# Altium project UCLA-DRS4-2.1.PrjPCB (part 5 of 7)

## Sheet 4V_DIST.SchDoc: My title
size A3; Organization: University of California; Address1: 475 Portola Plaza; Address2: Los Angeles, CA 90095; Revision: R01; SheetNumber: 1; SheetTotal: 1
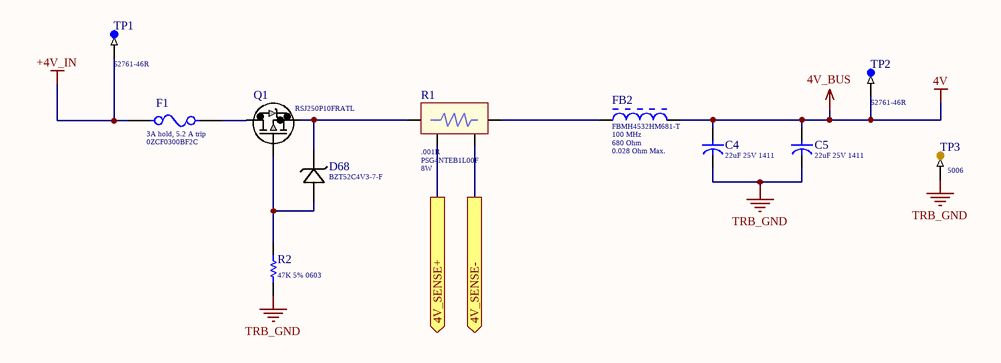
[diagram p16: 4V_DIST.SchDoc]

### Parts
C4  Capacitance: 22uF 25V 1411  [Cap_Kemet_T521B226M025ATE100_22uF]  (hidden comment: Cap_Kemet_T521B226M025ATE100_22uF)
C5  Capacitance: 22uF 25V 1411  [Cap_Kemet_T521B226M025ATE100_22uF]  (hidden comment: Cap_Kemet_T521B226M025ATE100_22uF)
D68  BZT52C4V3-7-F  [SOD123]
F1  3A hold, 5.2 A trip  [Bel_0ZCF_MFG]
FB2  Measuring Frequency: 100 MHz  Nominal Impedance: 680 Ohm  DC Resistance: 0.028 Ohm Max.  [TAYO-FBMH4532-2_V]  (hidden comment: FBMH4532HM681-T)
Q1  Series: RSJ250P10FRATL  [Mos_ROHM_RSJ250P10FRATL_25A]  (hidden comment: Mos_ROHM_RSJ250P10FRATL_25A)
R1  Resistance: .001R  Series: PSG4NTEB1L00F  Parameter 1: 8W  [SRes_KOA_PSG4NTEB1L00F_1mOhm]  (hidden comment: SRes_KOA_PSG4NTEB1L00F_1mOhm)
R2  47K 5% 0603  [RESC0603(1608)_L]
TP1  Series: S2761-46R  [TP_Harwin_S2761_46R]  (hidden comment: TP_Harwin_S2761_46R)
TP2  Series: S2761-46R  [TP_Harwin_S2761_46R]  (hidden comment: TP_Harwin_S2761_46R)
TP3  Series: 5006  [TP_Keystone_Electronics_5006]  (hidden comment: TP_Keystone_Electronics_5006)

### Ports
4V_SENSE+ (out), 4V_SENSE- (out)

### Nets
4V: C4.1 C5.1 FB2.2 TP2.1  [also labelled 4V_BUS]
+4V_IN: F1.1 TP1.1
TRB_GND: C4.2 C5.2 R2.1 TP3.1
4V_SENSE_N: R1.3 ; port 4V_SENSE-
4V_SENSE_P: R1.4 ; port 4V_SENSE+
NetD68_1: D68.1 Q1.3(S) R1.1
NetD68_2: D68.2 Q1.1(G) R2.2
NetF1_2: F1.2 Q1.2(D)
NetFB2_1: FB2.1 R1.2

### Notes on the sheet
- 475 Portola Plaza
- GAPS TOF
- igarcia91@g.ucla.edu
- Los Angeles, CA
- 310-825-0344
- Size:
- Date:
- Letter
- Number:
- Time:
- Sheet
- Revision:
- of
- andrew.peck@cern.ch
- spq@ucla.edu
- File:

### Library data of the parts
C4 C5 = Cap_Kemet_T521B226M025ATE100_22uF: Tantalum Capacitors - Polymer SMD 25V 22uF 1311 20% ESR=100mOhms; Supplier 1: Mouser; Supplier Part Number 1: 80-T521B226M25ATE100
D68 = BZT52C4V3-7-F: Zener Diodes 500mW 4.3V Zener AEC-Q101 Qualified; Vendor: Diodes Inc; Built_By: EMA_UL_Team; Type: DEV; C: Copyright (C) 2015 Accelerated Designs. All rights reserved; Manufacturer_Part_Number: BZT52C4V3-7-F; RefDes: RefDes; Supplier 1: Mouser; Supplier Part Number 1: 621-BZT52C4V3-F; Series: BZT52C4V3-7-F
F1 = 0ZCF0300BF2C: Resettable Fuses - PPTC 3A 24V PPTC 2920 SMD; Supplier 1: Mouser; Supplier 2: Digi-Key; Supplier Part Number 1: 530-0ZCF0300BF2C; Supplier Part Number 2: 507-2072-6-ND; Series: 0ZCF0300BF2C
FB2 = FBMH4532HM681-T: Chip Bead Inductor for Power Lines, 680 Ohm, 4 A, -40 to 125 degC, 2-Pin 4.5 x 3.2 x 3.5 mm SMD, RoHS, Taping; Manufacturer: Taiyo Yuden; Rated Current: 4 A Max.; Impedance Tolerance: +/- 25%; ComponentLink1Description: Manufacturer URL; ComponentLink2Description: Datasheet; DatasheetVersion: 09/2014; ComponentLink3URL: http://www.yuden.co.jp/productdata/catalog/en/chipbeads01_e.pdf; ComponentLink3Description: Package Specification; ComponentLink1URL: http://www.t-yuden.com/; Mounting Technology: Surface Mount; Packing: Taping; Temperature Range: -40 to 125 degC; PartNumber: FBMH4532HM681-T; PackageDescription: 2-Pin Surface Mount Device, Body 4.5 x 3.2 mm, Height 3.5 mm; ComponentLink2URL: http://www.yuden.co.jp/productdata/catalog/en/chipbeads01_e.pdf; RoHS: TRUE; Supplier 1: Digi-Key; Supplier Part Number 1: 587-1761-6-ND
Q1 = Mos_ROHM_RSJ250P10FRATL_25A: MOSFET Pch -100V Vds -25A 0.05Rds(on) 60Qg; Supplier 1: Mouser; Supplier Part Number 1: 755-RSJ250P10FRATL
R1 = SRes_KOA_PSG4NTEB1L00F_1mOhm: Current Sense Resistors - SMD 1mOhm 8W 1% 50ppm AEC-Q200 Power Shunt; Supplier 1: Mouser; Supplier Part Number 1: 660-PSG4NTEB1L00F
R2 = CMP-1012-00114-1: 47K 0.1W 5% 0603 (1608 Metric)  SMD; Case-EIA: 0603; Value: 47000.00 Ohm; Case-Metric: 1608; Tolerance: 5 %; Power: 0.1 W; Technology: SMT
TP1 TP2 = TP_Harwin_S2761_46R: Circuit Board Hardware - PCB SMT Mini Test Terminal, Reel; Supplier 1: Newark; Supplier Part Number 1: 76Y5391
TP3 = TP_Keystone_Electronics_5006: Circuit Board Hardware - PCB TEST POINT BLK .063; Supplier 1: Mouser; Supplier Part Number 1: 534-5006

## Sheet -1V_DIST.SchDoc: -1V Distribution
size Letter; SheetNumber: 9; SheetTotal: 32
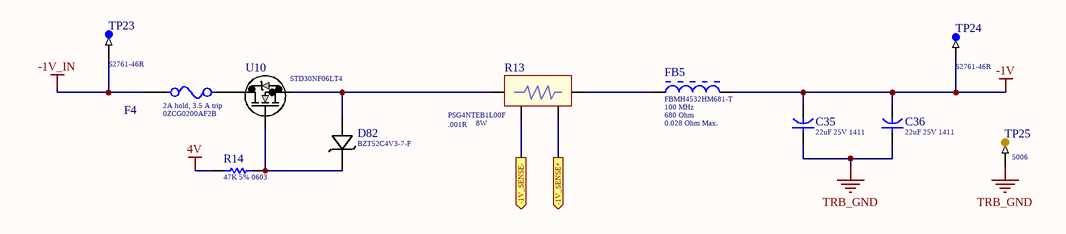
[diagram p17: -1V_DIST.SchDoc]

### Parts
C35  Capacitance: 22uF 25V 1411  [Cap_Kemet_T521B226M025ATE100_22uF]  (hidden comment: Cap_Kemet_T521B226M025ATE100_22uF)
C36  Capacitance: 22uF 25V 1411  [Cap_Kemet_T521B226M025ATE100_22uF]  (hidden comment: Cap_Kemet_T521B226M025ATE100_22uF)
D82  BZT52C4V3-7-F  [SOD123]
F4  2A hold, 3.5 A trip  [Bel_0ZCG_MFG]
FB5  Measuring Frequency: 100 MHz  Nominal Impedance: 680 Ohm  DC Resistance: 0.028 Ohm Max.  [TAYO-FBMH4532-2_V]  (hidden comment: FBMH4532HM681-T)
R13  Resistance: .001R  Series: PSG4NTEB1L00F  Parameter 1: 8W  [SRes_KOA_PSG4NTEB1L00F_1mOhm]  (hidden comment: SRes_KOA_PSG4NTEB1L00F_1mOhm)
R14  47K 5% 0603  [RESC0603(1608)_L]
TP23  Series: S2761-46R  [TP_Harwin_S2761_46R]  (hidden comment: TP_Harwin_S2761_46R)
TP24  Series: S2761-46R  [TP_Harwin_S2761_46R]  (hidden comment: TP_Harwin_S2761_46R)
TP25  Series: 5006  [TP_Keystone_Electronics_5006]  (hidden comment: TP_Keystone_Electronics_5006)
U10  STD30NF06LT4  [DPAK]

### Ports
-1V_SENSE+ (out), -1V_SENSE- (out)

### Nets
4V: R14.1
-1V: C35.2 C36.2 FB5.2 TP24.1
-1V_IN: F4.1 TP23.1
TRB_GND: C35.1 C36.1 TP25.1
-1V_SENSE_N: R13.4 ; port -1V_SENSE-
-1V_SENSE_P: R13.3 ; port -1V_SENSE+
NetD82_1: D82.1 R14.2 U10.1(G)
NetD82_2: D82.2 R13.1 U10.3(S)
NetF4_2: F4.2 U10.2(D)
NetFB5_1: FB5.1 R13.2

### Notes on the sheet
- 475 Portola Plaza
- GAPS TOF
- Title
- igarcia91@g.ucla.edu
- Los Angeles, CA
- 310-825-0344
- Size:
- Date:
- Letter
- Number:
- Time:
- Sheet
- Revision:
- of
- andrew.peck@cern.ch
- spq@ucla.edu
- File:

### Library data of the parts
C35 C36 = Cap_Kemet_T521B226M025ATE100_22uF: as C4 on sheet 4V_DIST; Supplier 1: Mouser; Supplier Part Number 1: 80-T521B226M25ATE100
D82 = BZT52C4V3-7-F: as D68 on sheet 4V_DIST; Manufacturer_Part_Number: BZT52C4V3-7-F; RefDes: RefDes; Supplier 1: Mouser; Supplier Part Number 1: 621-BZT52C4V3-F; Series: BZT52C4V3-7-F
F4 = 0ZCG0200AF2B: 2A hold, 3.5A trip; Supplier 1: Mouser; Supplier 2: Digi-Key; Supplier Part Number 2: 507-2074-6-ND; Supplier Part Number 1: 530-0ZCG0200AF2B; Series: 0ZCG0200AF2B
FB5 = FBMH4532HM681-T: as FB2 on sheet 4V_DIST; ComponentLink1Description: Manufacturer URL; ComponentLink2Description: Datasheet; DatasheetVersion: 09/2014; ComponentLink3URL: http://www.yuden.co.jp/productdata/catalog/en/chipbeads01_e.pdf; ComponentLink3Description: Package Specification; ComponentLink1URL: http://www.t-yuden.com/; Mounting Technology: Surface Mount; Packing: Taping; Temperature Range: -40 to 125 degC; PartNumber: FBMH4532HM681-T; PackageDescription: 2-Pin Surface Mount Device, Body 4.5 x 3.2 mm, Height 3.5 mm; ComponentLink2URL: http://www.yuden.co.jp/productdata/catalog/en/chipbeads01_e.pdf; RoHS: TRUE; Supplier 1: Digi-Key; Supplier Part Number 1: 587-1761-6-ND
R13 = SRes_KOA_PSG4NTEB1L00F_1mOhm: as R1 on sheet 4V_DIST; Supplier 1: Mouser; Supplier Part Number 1: 660-PSG4NTEB1L00F
R14 = CMP-1012-00114-1: as R2 on sheet 4V_DIST; Tolerance: 5 %; Power: 0.1 W; Technology: SMT
TP23 TP24 = TP_Harwin_S2761_46R: as TP1 on sheet 4V_DIST; Supplier 1: Newark; Supplier Part Number 1: 76Y5391
TP25 = TP_Keystone_Electronics_5006: as TP3 on sheet 4V_DIST; Supplier 1: Mouser; Supplier Part Number 1: 534-5006
U10 = STD30NF06LT4: MOSFET Automotive-grade N-channel 60 V, 19 mOhm typ., 24 A STripFET F6 Power MOSFET in a DPAK package; Vendor: STMicroelectronics; Built_By: EMA_UL_Team; C: Copyright (C) 2015 Accelerated Designs. All rights reserved; Manufacturer_Part_Number: STD30NF06LT4; RefDes: RefDes; Type: DEV; Value: Value; Supplier 1: Mouser; Supplier Part Number 1: 511-STD30NF06L

## Sheet 3V_ADC_SUPPLY.SchDoc: 3V ADC
size Letter; Organization: University of California; Address1: 475 Portola Plaza; Address2: Los Angeles, CA 90095; Revision: R01; SheetNumber: 7; SheetTotal: 32
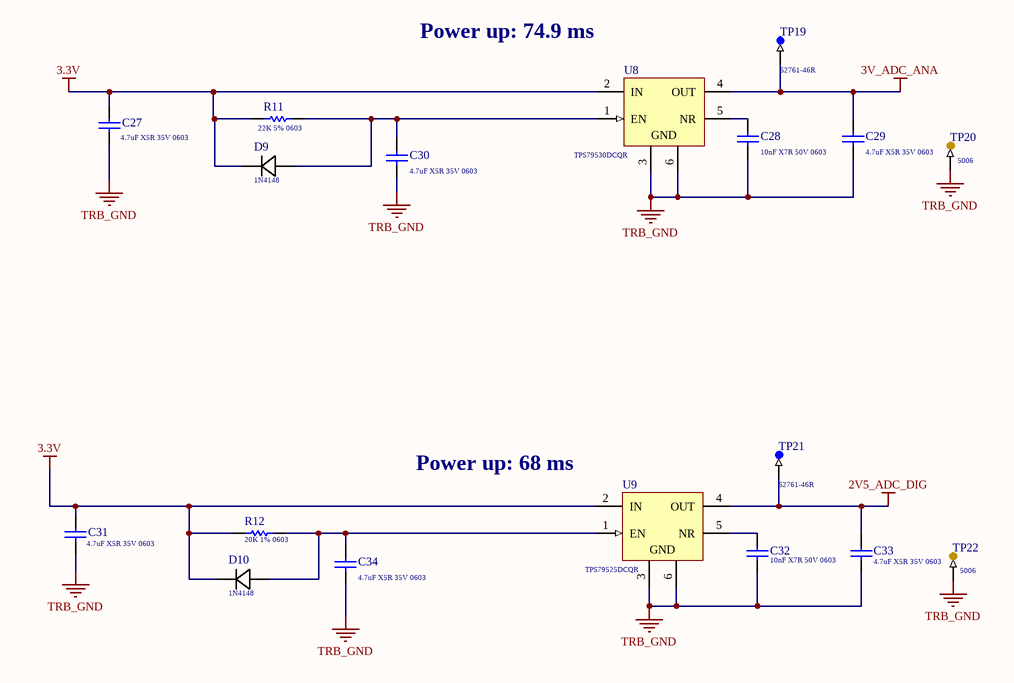
[diagram p18: 3V_ADC_SUPPLY.SchDoc]

### Parts
C27  Capacitance: 4.7uF X5R 35V 0603  [Cap_Murata_ZRB18AR6YA475ME05L_4.7uF]  (hidden comment: Cap_Murata_ZRB18AR6YA475ME05L_4.7uF)
C28  Capacitance: 10nF X7R 50V 0603  [Kemet_C0603_0]  (hidden comment: Cap_Kemet_C0603C103J5RACTU_eec)
C29  Capacitance: 4.7uF X5R 35V 0603  [Cap_Murata_ZRB18AR6YA475ME05L_4.7uF]  (hidden comment: Cap_Murata_ZRB18AR6YA475ME05L_4.7uF)
C30  Capacitance: 4.7uF X5R 35V 0603  [Cap_Murata_ZRB18AR6YA475ME05L_4.7uF]  (hidden comment: Cap_Murata_ZRB18AR6YA475ME05L_4.7uF)
C31  Capacitance: 4.7uF X5R 35V 0603  [Cap_Murata_ZRB18AR6YA475ME05L_4.7uF]  (hidden comment: Cap_Murata_ZRB18AR6YA475ME05L_4.7uF)
C32  Capacitance: 10nF X7R 50V 0603  [Kemet_C0603_0]  (hidden comment: Cap_Kemet_C0603C103J5RACTU_eec)
C33  Capacitance: 4.7uF X5R 35V 0603  [Cap_Murata_ZRB18AR6YA475ME05L_4.7uF]  (hidden comment: Cap_Murata_ZRB18AR6YA475ME05L_4.7uF)
C34  Capacitance: 4.7uF X5R 35V 0603  [Cap_Murata_ZRB18AR6YA475ME05L_4.7uF]  (hidden comment: Cap_Murata_ZRB18AR6YA475ME05L_4.7uF)
D9  Series: 1N4148  [Diode_ON_Semiconductor_1N4148WT_300mA]  (hidden comment: Diode_ON_Semiconductor_1N4148WT_300mA)
D10  Series: 1N4148  [Diode_ON_Semiconductor_1N4148WT_300mA]  (hidden comment: Diode_ON_Semiconductor_1N4148WT_300mA)
R11  22K 5% 0603  [RESC0603(1608)_L]
R12  20K 1% 0603  [RESC0603(1608)_L]
TP19  Series: S2761-46R  [TP_Harwin_S2761_46R]  (hidden comment: TP_Harwin_S2761_46R)
TP20  Series: 5006  [TP_Keystone_Electronics_5006]  (hidden comment: TP_Keystone_Electronics_5006)
TP21  Series: S2761-46R  [TP_Harwin_S2761_46R]  (hidden comment: TP_Harwin_S2761_46R)
TP22  Series: 5006  [TP_Keystone_Electronics_5006]  (hidden comment: TP_Keystone_Electronics_5006)
U8  TPS79530DCQR  [TI-DCQ6_N]
U9  TPS79525DCQR  [DCQ0006A_N]

### Nets
2V5_ADC_DIG: C33.2 TP21.1 U9.4(OUT)
3.3V: C27.2 C31.2 D9.1 D10.1 R11.1 R12.2 U8.2(IN) U9.2(IN)
3V_ADC_ANA: C29.2 TP19.1 U8.4(OUT)
TRB_GND: C27.1 C28.2 C29.1 C30.1 C31.1 C32.2 C33.1 C34.1 TP20.1 TP22.1 U8.3(GND) U8.6(GND) U9.3(GND) U9.6(GND)
NetC28_1: C28.1 U8.5(NR)
NetC30_2: C30.2 D9.2 R11.2 U8.1(EN)
NetC32_1: C32.1 U9.5(NR)
NetC34_2: C34.2 D10.2 R12.1 U9.1(EN)

### Notes on the sheet
- (near U8) Power up: 74.9 ms
- (near U9) Power up: 68 ms
- 475 Portola Plaza
- GAPS TOF
- Title
- igarcia91@g.ucla.edu
- Los Angeles, CA
- 310-825-0344
- Size:
- Date:
- Letter
- Number:
- Time:
- Sheet
- Revision:
- of
- andrew.peck@cern.ch
- spq@ucla.edu
- File:

### Library data of the parts
C27 C29-C31 C33 C34 = Cap_Murata_ZRB18AR6YA475ME05L_4.7uF: CAP CER 4.7uF 35V X5R 0603; Supplier 1: Mouser; Supplier Part Number 1: 81-ZRB18AR6YA475ME5L
C28 C32 = Cap_Kemet_C0603C103J5RACTU_eec: CAP CER 10nF 50V X7R 0603; Manufacturer: Kemet; Mfg Package Ident: C0603; Part Number: C0603C103J5RACTU; helpURL: https://upverter.com/upn/revision/8a8d0c297e33ac74/; ComponentLink2Description: Datasheet; Temperature: -55°C to +125°C; Package: C0603; Supplier 2: Mouser; Price: 0.0184203126773; Supplier 1: Digi-Key; ComponentLink1URL: https://upverter.com/upn/revision/8a8d0c297e33ac74/; Supplier Part Number 2: 80-C0603C103J5R; Supplier Part Number 1: 399-1092-1-ND; Value: 10nF; ComponentLink1Description: Upverter; ComponentLink2URL: https://content.kemet.com/datasheets/KEM_C1002_X7R_SMD.pdf; RoHS: TRUE; Mouser Part Number: 80-C0603C103J5R; Temperature Range High: +125°C; Digikey Description: CAP CER 10000PF 50V X7R 0603; Digikey Part Number: 399-1092-1-ND; Lead Free: yes; Temperature Range Low: -55°C; Voltage: 50V
D9 D10 = Diode_ON_Semiconductor_1N4148WT_300mA: Diodes - General Purpose, Power, Switching SINGLE JUNC. 75V 4.0NS COMP; Supplier 1: Mouser; Supplier Part Number 1: 512-1N4148WT
R11 = CMP-1012-00106-1: 22K 0.1W 5% 0603 (1608 Metric)  SMD; Case-Metric: 1608; Value: 22000.00 Ohm; Case-EIA: 0603; Power: 0.1 W; Tolerance: 5 %; Technology: SMT
R12 = CMP-1012-00655-1: 20K 0.1W 1% 0603 (1608 Metric)  SMD; Case-Metric: 1608; Case-EIA: 0603; Value: 20000.00 Ohm; Technology: SMT; Tolerance: 1 %; Power: 0.1 W
TP19 TP21 = TP_Harwin_S2761_46R: as TP1 on sheet 4V_DIST; Supplier 1: Newark; Supplier Part Number 1: 76Y5391
TP20 TP22 = TP_Keystone_Electronics_5006: as TP3 on sheet 4V_DIST; Supplier 1: Mouser; Supplier Part Number 1: 534-5006
U8 = TPS79530DCQR: Single Output High PSRR LDO, 500 mA, Fixed 3 V Output, 2.7 to 5.5 V Input, 6-pin SOT-223 (DCQ), -40 to 125 degC, Green (RoHS & no Sb/Br); Manufacturer: Texas Instruments; Accuracy(%): 2; Iq(Typ)(mA): 0.26; Vin(Min)(V): 2.7; Vout Adj(Min)(V): 3; SubFamily: Single Channel LDO; Vin(Max)(V): 5.5; Rating: Catalog; Iout(Max)(A): 0.5; Vdo(Typ)(mV): 110; Eco-Plan: Green (RoHS & no Sb/Br); PartNumber: TPS79530DCQR; ComponentLink1Description: Manufacturer URL; ComponentLink2Description: Datasheet; DatasheetVersion: SLVS350H; ComponentLink3URL: http://www.ti.com/litv/pdf/mpds098c; Vout Adj(Max)(V): 3; ComponentLink1URL: http://www.ti.com/; Fixed Output Options(V): 3; ComponentLink2URL: http://www.ti.com/general/docs/lit/getliterature.tsp?genericPartNumber=TPS79530&fileType=pdf; ComponentLink3Description: Package Specification; PackageVersion: 4202109/D; Mounting Technology: Surface Mount; PackageReference: DCQ6; PackageDescription: 6-Pin Plastic Small Outline, Body 3.5 x 6.5 mm, Pitch 1.27 mm; Supplier 1: Mouser; Supplier Part Number 1: 595-TPS79530DCQR
U9 = TPS79525DCQR: Single Output High PSRR LDO, 500 mA, Fixed 2.5 V Output, 2.7 to 5.5 V Input, 6-pin SOT-223 (DCQ), -40 to 125 degC, Green (RoHS & no Sb/Br); Manufacturer: Texas Instruments; Accuracy(%): 2; Iq(Typ)(mA): 0.26; Vin(Min)(V): 2.7; Vout Adj(Min)(V): 2.5; SubFamily: Single Channel LDO; Vin(Max)(V): 5.5; Rating: Catalog; Iout(Max)(A): 0.5; Vdo(Typ)(mV): 110; Eco-Plan: Green (RoHS & no Sb/Br); PartNumber: TPS79525DCQR; ComponentLink1Description: Manufacturer URL; ComponentLink2Description: Datasheet; DatasheetVersion: SLVS350H; ComponentLink3URL: http://www.ti.com/litv/pdf/mpds098c; Vout Adj(Max)(V): 2.5; ComponentLink1URL: http://www.ti.com/; Fixed Output Options(V): 2.5; ComponentLink2URL: http://www.ti.com/general/docs/lit/getliterature.tsp?genericPartNumber=TPS79525&fileType=pdf; PackageReference: DCQ0006A; ComponentLink3Description: Package Specification; PackageVersion: 4202109/D; Mounting Technology: Surface Mount; PackageDescription: 6-Pin Plastic Small Outline, Body 3.5 x 6.5 mm, Pitch 1.27 mm; Supplier 1: Mouser; Supplier 2: Digi-Key; Supplier 3: Arrow; Supplier Part Number 3: TPS79525DCQR; Supplier Part Number 2: 296-41778-6-ND; Supplier Part Number 1: 595-TPS79525DCQR

## Sheet MarsCarrier_PWR.SchDoc: Mars PWR
size OrCAD B; SheetNumber: 11; SheetTotal: 32
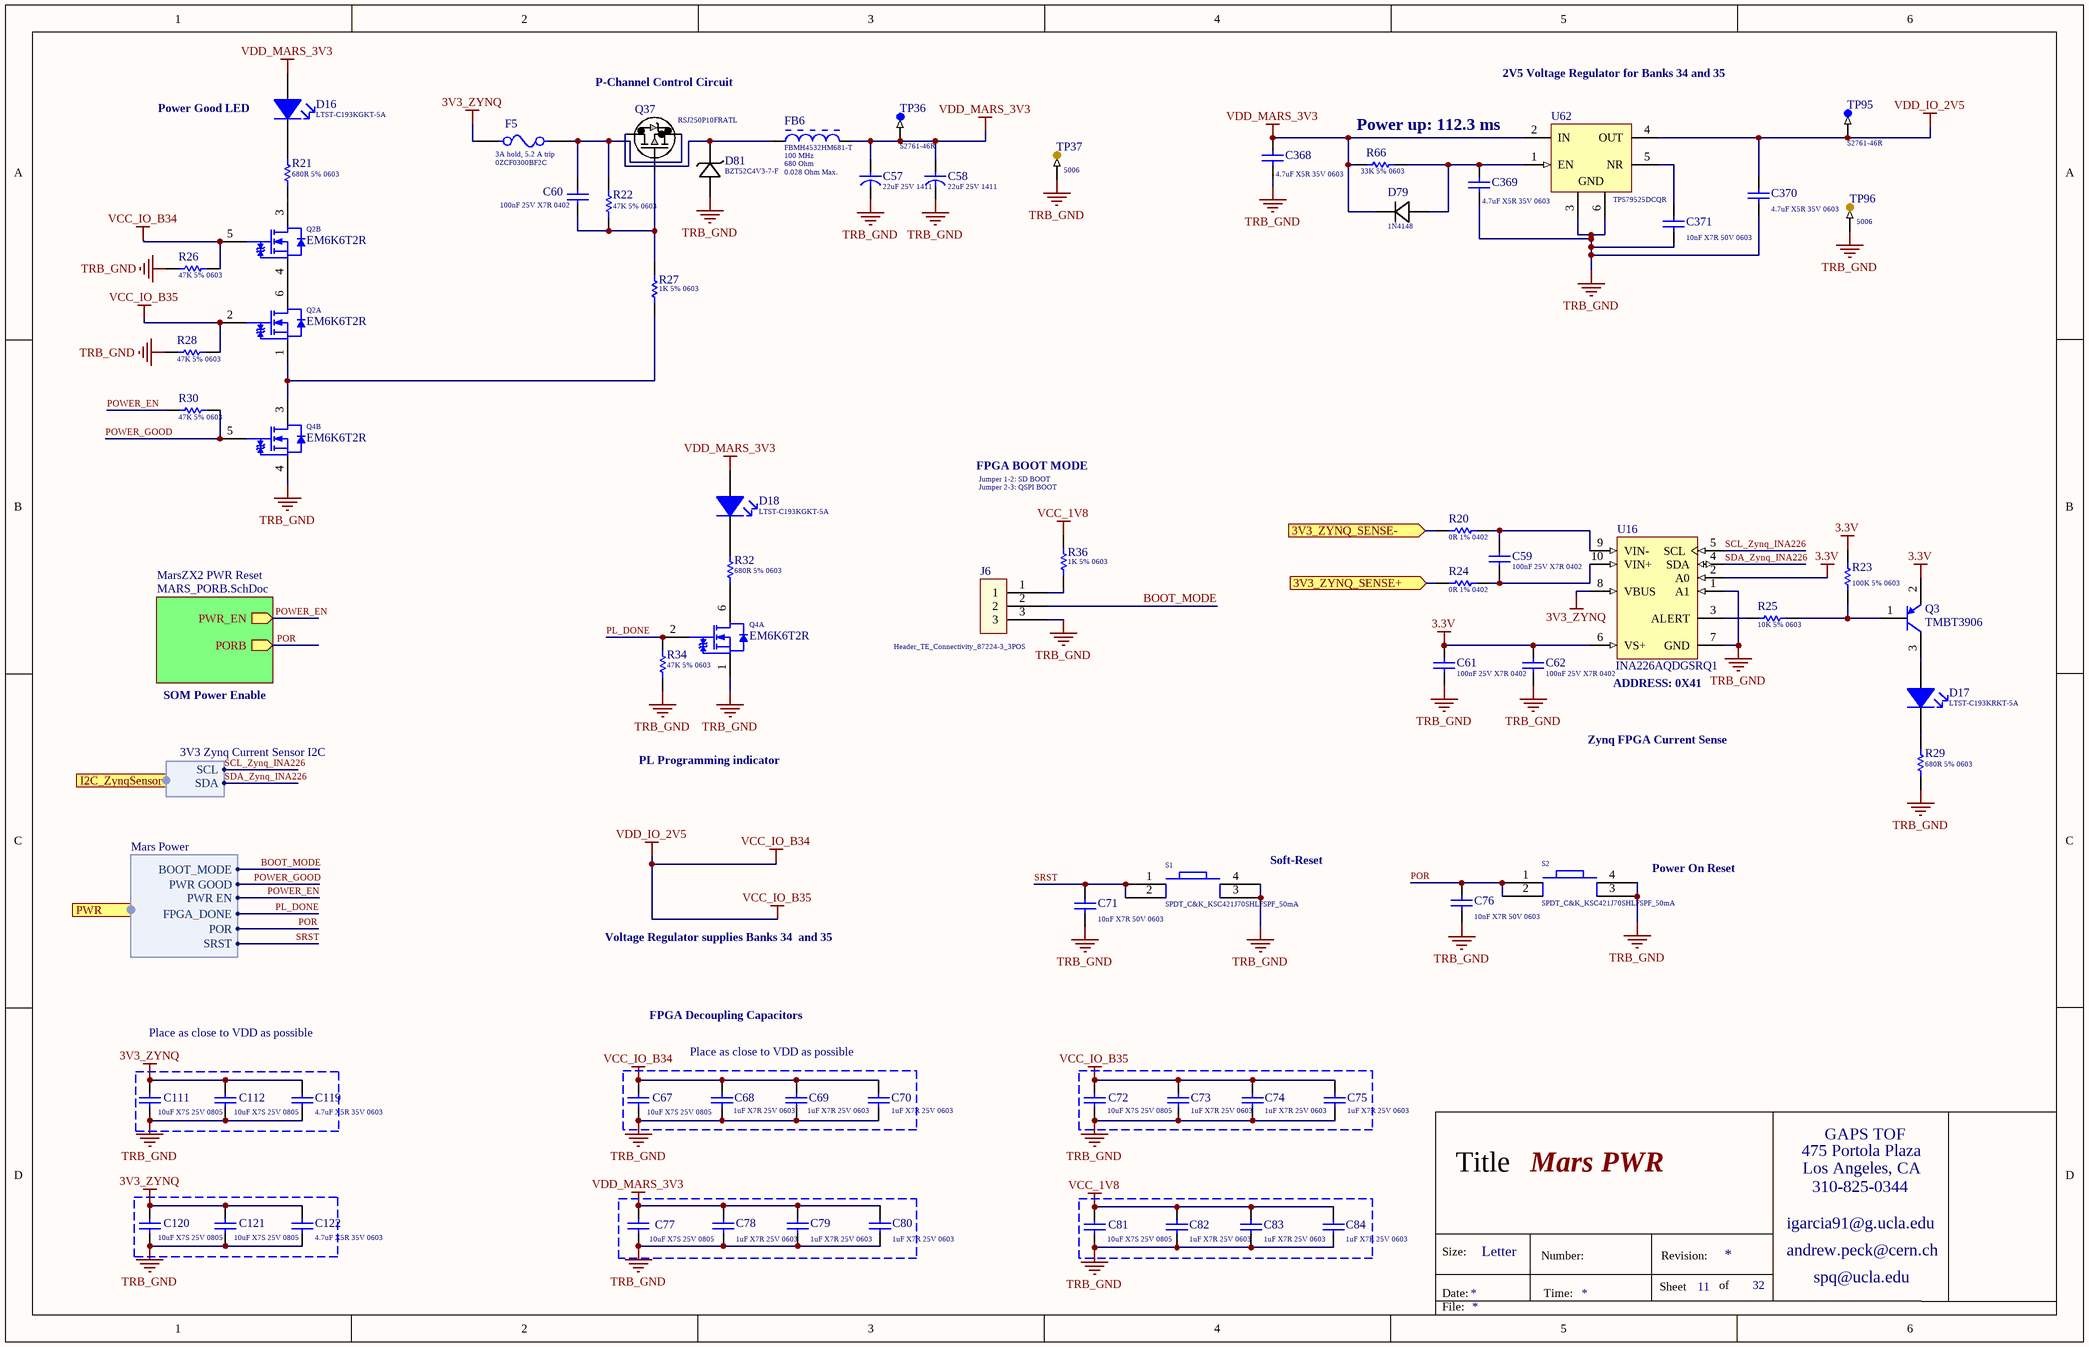
[diagram p19: MarsCarrier_PWR.SchDoc]

### Parts
C57  Capacitance: 22uF 25V 1411  [Cap_Kemet_T521B226M025ATE100_22uF]  (hidden comment: Cap_Kemet_T521B226M025ATE100_22uF)
C58  Capacitance: 22uF 25V 1411  [Cap_Kemet_T521B226M025ATE100_22uF]  (hidden comment: Cap_Kemet_T521B226M025ATE100_22uF)
C59  Capacitance: 100nF 25V X7R 0402  [Cap_Taiyo_Yuden_TMK105B7104KV-FR_100nF]  (hidden comment: Cap_Taiyo_Yuden_TMK105B7104KV-FR_100nF)
C60  Capacitance: 100nF 25V X7R 0402  [Cap_Taiyo_Yuden_TMK105B7104KV-FR_100nF]  (hidden comment: Cap_Taiyo_Yuden_TMK105B7104KV-FR_100nF)
C61  Capacitance: 100nF 25V X7R 0402  [Cap_Taiyo_Yuden_TMK105B7104KV-FR_100nF]  (hidden comment: Cap_Taiyo_Yuden_TMK105B7104KV-FR_100nF)
C62  Capacitance: 100nF 25V X7R 0402  [Cap_Taiyo_Yuden_TMK105B7104KV-FR_100nF]  (hidden comment: Cap_Taiyo_Yuden_TMK105B7104KV-FR_100nF)
C67  Capacitance: 10uF X7S 25V 0805  [Cap_Murata_ GRM21BC71E106ME11L_10uF]  (hidden comment: Cap_Murata_ GRM21BC71E106ME11L_10uF)
C68  Capacitance: 1uF X7R 25V 0603  [Cap_Murata_GCJ188R71E105KA01J_1uF]  (hidden comment: Cap_Murata_GCJ188R71E105KA01J_1uF)
C69  Capacitance: 1uF X7R 25V 0603  [Cap_Murata_GCJ188R71E105KA01J_1uF]  (hidden comment: Cap_Murata_GCJ188R71E105KA01J_1uF)
C70  Capacitance: 1uF X7R 25V 0603  [Cap_Murata_GCJ188R71E105KA01J_1uF]  (hidden comment: Cap_Murata_GCJ188R71E105KA01J_1uF)
C71  Capacitance: 10nF X7R 50V 0603  [Kemet_C0603_0]  (hidden comment: Cap_Kemet_C0603C103J5RACTU_eec)
C72  Capacitance: 10uF X7S 25V 0805  [Cap_Murata_ GRM21BC71E106ME11L_10uF]  (hidden comment: Cap_Murata_ GRM21BC71E106ME11L_10uF)
C73  Capacitance: 1uF X7R 25V 0603  [Cap_Murata_GCJ188R71E105KA01J_1uF]  (hidden comment: Cap_Murata_GCJ188R71E105KA01J_1uF)
C74  Capacitance: 1uF X7R 25V 0603  [Cap_Murata_GCJ188R71E105KA01J_1uF]  (hidden comment: Cap_Murata_GCJ188R71E105KA01J_1uF)
C75  Capacitance: 1uF X7R 25V 0603  [Cap_Murata_GCJ188R71E105KA01J_1uF]  (hidden comment: Cap_Murata_GCJ188R71E105KA01J_1uF)
C76  Capacitance: 10nF X7R 50V 0603  [Kemet_C0603_0]  (hidden comment: Cap_Kemet_C0603C103J5RACTU_eec)
C77  Capacitance: 10uF X7S 25V 0805  [Cap_Murata_ GRM21BC71E106ME11L_10uF]  (hidden comment: Cap_Murata_ GRM21BC71E106ME11L_10uF)
C78  Capacitance: 1uF X7R 25V 0603  [Cap_Murata_GCJ188R71E105KA01J_1uF]  (hidden comment: Cap_Murata_GCJ188R71E105KA01J_1uF)
C79  Capacitance: 1uF X7R 25V 0603  [Cap_Murata_GCJ188R71E105KA01J_1uF]  (hidden comment: Cap_Murata_GCJ188R71E105KA01J_1uF)
C80  Capacitance: 1uF X7R 25V 0603  [Cap_Murata_GCJ188R71E105KA01J_1uF]  (hidden comment: Cap_Murata_GCJ188R71E105KA01J_1uF)
C81  Capacitance: 10uF X7S 25V 0805  [Cap_Murata_ GRM21BC71E106ME11L_10uF]  (hidden comment: Cap_Murata_ GRM21BC71E106ME11L_10uF)
C82  Capacitance: 1uF X7R 25V 0603  [Cap_Murata_GCJ188R71E105KA01J_1uF]  (hidden comment: Cap_Murata_GCJ188R71E105KA01J_1uF)
C83  Capacitance: 1uF X7R 25V 0603  [Cap_Murata_GCJ188R71E105KA01J_1uF]  (hidden comment: Cap_Murata_GCJ188R71E105KA01J_1uF)
C84  Capacitance: 1uF X7R 25V 0603  [Cap_Murata_GCJ188R71E105KA01J_1uF]  (hidden comment: Cap_Murata_GCJ188R71E105KA01J_1uF)
C111  Capacitance: 10uF X7S 25V 0805  [Cap_Murata_ GRM21BC71E106ME11L_10uF]  (hidden comment: Cap_Murata_ GRM21BC71E106ME11L_10uF)
C112  Capacitance: 10uF X7S 25V 0805  [Cap_Murata_ GRM21BC71E106ME11L_10uF]  (hidden comment: Cap_Murata_ GRM21BC71E106ME11L_10uF)
C119  Capacitance: 4.7uF X5R 35V 0603  [Cap_Murata_ZRB18AR6YA475ME05L_4.7uF]  (hidden comment: Cap_Murata_ZRB18AR6YA475ME05L_4.7uF)
C120  Capacitance: 10uF X7S 25V 0805  [Cap_Murata_ GRM21BC71E106ME11L_10uF]  (hidden comment: Cap_Murata_ GRM21BC71E106ME11L_10uF)
C121  Capacitance: 10uF X7S 25V 0805  [Cap_Murata_ GRM21BC71E106ME11L_10uF]  (hidden comment: Cap_Murata_ GRM21BC71E106ME11L_10uF)
C122  Capacitance: 4.7uF X5R 35V 0603  [Cap_Murata_ZRB18AR6YA475ME05L_4.7uF]  (hidden comment: Cap_Murata_ZRB18AR6YA475ME05L_4.7uF)
C368  Capacitance: 4.7uF X5R 35V 0603  [Cap_Murata_ZRB18AR6YA475ME05L_4.7uF]  (hidden comment: Cap_Murata_ZRB18AR6YA475ME05L_4.7uF)
C369  Capacitance: 4.7uF X5R 35V 0603  [Cap_Murata_ZRB18AR6YA475ME05L_4.7uF]  (hidden comment: Cap_Murata_ZRB18AR6YA475ME05L_4.7uF)
C370  Capacitance: 4.7uF X5R 35V 0603  [Cap_Murata_ZRB18AR6YA475ME05L_4.7uF]  (hidden comment: Cap_Murata_ZRB18AR6YA475ME05L_4.7uF)
C371  Capacitance: 10nF X7R 50V 0603  [Kemet_C0603_0]  (hidden comment: Cap_Kemet_C0603C103J5RACTU_eec)
D16  Series: LTST-C193KGKT-5A  [Led_Lite-On_LTST-C193KGKT-5A_Green]  (hidden comment: Led_Lite-On_LTST-C193KGKT-5A_Green)
D17  LTST-C193KRKT-5A  [Led_Lite-On_LTST-C193KGKT-5A_Red]
D18  Series: LTST-C193KGKT-5A  [Led_Lite-On_LTST-C193KGKT-5A_Green]  (hidden comment: Led_Lite-On_LTST-C193KGKT-5A_Green)
D79  Series: 1N4148  [Diode_ON_Semiconductor_1N4148WT_300mA]  (hidden comment: Diode_ON_Semiconductor_1N4148WT_300mA)
D81  BZT52C4V3-7-F  [SOD123]
F5  3A hold, 5.2 A trip  [Bel_0ZCF_MFG]
FB6  Measuring Frequency: 100 MHz  Nominal Impedance: 680 Ohm  DC Resistance: 0.028 Ohm Max.  [TAYO-FBMH4532-2_V]  (hidden comment: FBMH4532HM681-T)
J6  Header_TE_Connectivity_87224-3_3POS  [Header_TE_Connectivity_87224-3_3POS]
Q2  Series: EM6K6T2R  [Mos_ROHM_EM6K6T2R_N_300mA]  (hidden comment: Mos_ROHM_EM6K6T2R_N_300mA)  (parts A,B of 2)
Q3  Series: TMBT3906  [BJT_PNP_Toshiba_TMBT3906]  (hidden comment: BJT_PNP_Toshiba_TMBT3906)
Q4  Series: EM6K6T2R  [Mos_ROHM_EM6K6T2R_N_300mA]  (hidden comment: Mos_ROHM_EM6K6T2R_N_300mA)  (parts A,B of 2)
Q37  Series: RSJ250P10FRATL  [Mos_ROHM_RSJ250P10FRATL_25A]  (hidden comment: Mos_ROHM_RSJ250P10FRATL_25A)
R20  Resistance: 0R 1% 0402  [Res_Vishay_CRCW04020000Z0EDC_0_Ohm]  (hidden comment: Res_Vishay_CRCW04020000Z0EDC_0_Ohm)
R21  680R 5% 0603  [RESC0603(1608)_L]
R22  47K 5% 0603  [RESC0603(1608)_L]
R23  100K 5% 0603  [RESC0603(1608)_N]
R24  Resistance: 0R 1% 0402  [Res_Vishay_CRCW04020000Z0EDC_0_Ohm]  (hidden comment: Res_Vishay_CRCW04020000Z0EDC_0_Ohm)
R25  10K 5% 0603  [RESC0603(1608)_L]
R26  47K 5% 0603  [RESC0603(1608)_L]
R27  1K 5% 0603  [RESC0603(1608)_L]
R28  47K 5% 0603  [RESC0603(1608)_L]
R29  680R 5% 0603  [RESC0603(1608)_L]
R30  47K 5% 0603  [RESC0603(1608)_L]
R32  680R 5% 0603  [RESC0603(1608)_L]
R34  47K 5% 0603  [RESC0603(1608)_L]
R36  1K 5% 0603  [RESC0603(1608)_L]
R66  33K 5% 0603  [RESC0603(1608)_L]
S1  SPDT_C&K_KSC421J70SHLFSPF_50mA  [SPDT_C&K_KSC421J70SHLFSPF_50mA]
S2  SPDT_C&K_KSC421J70SHLFSPF_50mA  [SPDT_C&K_KSC421J70SHLFSPF_50mA]
TP36  Series: S2761-46R  [TP_Harwin_S2761_46R]  (hidden comment: TP_Harwin_S2761_46R)
TP37  Series: 5006  [TP_Keystone_Electronics_5006]  (hidden comment: TP_Keystone_Electronics_5006)
TP95  Series: S2761-46R  [TP_Harwin_S2761_46R]  (hidden comment: TP_Harwin_S2761_46R)
TP96  Series: 5006  [TP_Keystone_Electronics_5006]  (hidden comment: TP_Keystone_Electronics_5006)
U16  INA226AQDGSRQ1  [INA226AQDGSRQ1]
U62  TPS79525DCQR  [DCQ0006A_L]

### Blocks framed on the sheet
Place as close to VDD as possible: C67-C70

### Sub-sheets
MarsZX2 PWR Reset = MARS_PORB.SchDoc: PWR_EN (out), PORB (out)

### Ports
3V3_ZYNQ_SENSE+ (in), 3V3_ZYNQ_SENSE- (in), I2C_ZynqSensor (harness 3V3 Zynq Current Sensor I2C), PWR (harness Mars Power)

### Harnesses
Mars Power: PWR GOOD, PWR EN, FPGA_DONE, SRST, POR, BOOT_MODE
3V3 Zynq Current Sensor I2C: SCL, SDA

### Nets
3.3V: C61.2 C62.2 Q3.2(E) R23.2 U16.2(A0) U16.6(VS+)
3V3_ZYNQ: C111.1 C112.1 C119.1 C120.1 C121.1 C122.1 F5.1 U16.8(VBUS)  [project net VCC_3V3]
TRB_GND: C57.2 C58.2 C61.1 C62.1 C67.2 C68.1 C69.1 C70.1 C71.2 C72.2 C73.1 C74.1 C75.1 C76.2 C77.2 C78.1 C79.1 C80.1 C81.2 C82.1 C83.1 C84.1 C111.2 C112.2 C119.2 C120.2 C121.2 C122.2 C368.1 C369.1 C370.1 C371.2 D81.2 J6.3 Q4.1(S) Q4.4(S) R26.2 R28.2 R29.1 R34.1 S1.3 S1.4 S2.3 S2.4 TP37.1 TP96.1 U16.1(A1) U16.7(GND) U62.3(GND) U62.6(GND)
VCC_1V8: C81.1 C82.2 C83.2 C84.2 R36.2  [project net VCC_1V8_PS]
VCC_IO_B34: C67.1 C68.2 C69.2 C70.2 C72.1 C73.2 C74.2 C75.2 C370.2 Q2.2(G) Q2.5(G) R26.1 R28.1 TP95.1 U62.4(OUT)  [also labelled VCC_IO_B35, VDD_IO_2V5]
VDD_MARS_3V3: C57.1 C58.1 C77.1 C78.2 C79.2 C80.2 C368.2 D16.2(A) D18.2(A) D79.1 FB6.2 R66.1 TP36.1 U62.2(IN)
3V3_ZYNQ_SENSE_N: R20.1 ; port 3V3_ZYNQ_SENSE-
3V3_ZYNQ_SENSE_P: R24.1 ; port 3V3_ZYNQ_SENSE+
BOOT_MODE: J6.2 ; port PWR.BOOT_MODE
PL_DONE: Q4.2(G) R34.2 ; port PWR.FPGA_DONE  [project net FPGA_DONE]
POR: C76.1 S2.1 S2.2 ; sheet MarsZX2 PWR Reset/PORB, port PWR.POR
POWER_EN: R30.2 ; sheet MarsZX2 PWR Reset/PWR_EN, port PWR.PWR EN
POWER_GOOD: Q4.5(G) R30.1 ; port PWR.PWR GOOD
SCL_Zynq_INA226: U16.5(SCL) ; port I2C_ZynqSensor.SCL
SDA_Zynq_INA226: U16.4(SDA) ; port I2C_ZynqSensor.SDA
SRST: C71.1 S1.1 S1.2 ; port PWR.SRST  [project net PS_SRST#]
NetC59_1: C59.1 R24.2 U16.10(VIN+)
NetC59_2: C59.2 R20.2 U16.9(VIN-)
NetC60_1: C60.1 Q37.1(G) R22.1 R27.2
NetC60_2: C60.2 F5.2 Q37.3(S) R22.2
NetC369_2: C369.2 D79.2 R66.2 U62.1(EN)
NetC371_1: C371.1 U62.5(NR)
NetD16_1: D16.1(K) R21.2
NetD17_1: D17.1(K) R29.2
NetD17_2: D17.2(A) Q3.3(C)
NetD18_1: D18.1(K) R32.2
NetD81_1: D81.1 FB6.1 Q37.2(D)
NetJ6_1: J6.1 R36.1
NetQ2_1: Q2.1(S) Q4.3(D) R27.1
NetQ2_3: Q2.3(D) R21.1
NetQ2_4: Q2.4(S) Q2.6(D)
NetQ3_1: Q3.1(B) R23.1 R25.1
NetQ4_6: Q4.6(D) R32.1
NetR25_2: R25.2 U16.3(ALERT)

### Notes on the sheet
- P-Channel Control Circuit
- 2V5 Voltage Regulator for Banks 34 and 35
- Power Good LED
- Power up: 112.3 ms
- FPGA BOOT MODE
- Jumper 1-2: SD BOOT
- Jumper 2-3: QSPI BOOT
- (near U16) ADDRESS: 0X41
- SOM Power Enable
- Zynq FPGA Current Sense
- PL Programming indicator
- (near S1) Soft-Reset
- Power On Reset
- Voltage Regulator supplies Banks 34  and 35
- FPGA Decoupling Capacitors
- Place as close to VDD as possible
- 475 Portola Plaza
- GAPS TOF
- Title
- igarcia91@g.ucla.edu
- Los Angeles, CA
- 310-825-0344
- Size:
- Date:
- Letter
- Number:
- Time:
- Sheet
- Revision:
- of
- andrew.peck@cern.ch
- spq@ucla.edu
- File:

### Library data of the parts
C57 C58 = Cap_Kemet_T521B226M025ATE100_22uF: as C4 on sheet 4V_DIST; Supplier 1: Mouser; Supplier Part Number 1: 80-T521B226M25ATE100
C59-C62 = Cap_Taiyo_Yuden_TMK105B7104KV-FR_100nF: CAP CER 100nF 25V X7R 0402; Supplier 1: Mouser; Supplier Part Number 1: 963-TMK105B7104KV-FR
C67 C72 C77 C81 C111 C112 C120 C121 = Cap_Murata_ GRM21BC71E106ME11L_10uF: CAP CER 10uF 25V X7R 0805; Supplier 1: Mouser; Supplier Part Number 1: 81-GRM21BC71E106ME1L
C68-C70 C73-C75 C78-C80 C82-C84 = Cap_Murata_GCJ188R71E105KA01J_1uF: CAP CER 1uF 25V X7R 0603; Supplier 1: Mouser; Supplier Part Number 1: 81-GCJ188R71E105KA1J
C71 C76 C371 = Cap_Kemet_C0603C103J5RACTU_eec: as C28 on sheet 3V_ADC_SUPPLY; Part Number: C0603C103J5RACTU; helpURL: https://upverter.com/upn/revision/8a8d0c297e33ac74/; ComponentLink2Description: Datasheet; Temperature: -55°C to +125°C; Package: C0603; Supplier 2: Mouser; Price: 0.0184203126773; Supplier 1: Digi-Key; ComponentLink1URL: https://upverter.com/upn/revision/8a8d0c297e33ac74/; Supplier Part Number 2: 80-C0603C103J5R; Supplier Part Number 1: 399-1092-1-ND; Value: 10nF; ComponentLink1Description: Upverter; ComponentLink2URL: https://content.kemet.com/datasheets/KEM_C1002_X7R_SMD.pdf; RoHS: TRUE; Mouser Part Number: 80-C0603C103J5R; Temperature Range High: +125°C; Digikey Description: CAP CER 10000PF 50V X7R 0603; Digikey Part Number: 399-1092-1-ND; Lead Free: yes; Temperature Range Low: -55°C; Voltage: 50V
C119 C122 C368-C370 = Cap_Murata_ZRB18AR6YA475ME05L_4.7uF: CAP CER 4.7uF 35V X5R 0603; Supplier 1: Mouser; Supplier Part Number 1: 81-ZRB18AR6YA475ME5L
D16 D18 = Led_Lite-On_LTST-C193KGKT-5A_Green: Standard LEDs - SMD Green 470nm 28mcd 20mA; Supplier 1: Mouser; Supplier Part Number 1: 859-LTSTC193KGKT5A
D17 = Led_Lite-On_LTST-C193KGKT-5A_Red: Standard LEDs - SMD Red 470nm 28mcd 20mA; Supplier 1: Mouser; Supplier Part Number 1: 859-LTSTC193KRKT5A; Series: LTST-C193KRKT-5A
D79 = Diode_ON_Semiconductor_1N4148WT_300mA: as D9 on sheet 3V_ADC_SUPPLY; Supplier 1: Mouser; Supplier Part Number 1: 512-1N4148WT
D81 = BZT52C4V3-7-F: as D68 on sheet 4V_DIST; Manufacturer_Part_Number: BZT52C4V3-7-F; RefDes: RefDes; Supplier 1: Mouser; Supplier Part Number 1: 621-BZT52C4V3-F; Series: BZT52C4V3-7-F
F5 = 0ZCF0300BF2C: as F1 on sheet 4V_DIST; Supplier 1: Mouser; Supplier 2: Digi-Key; Supplier Part Number 1: 530-0ZCF0300BF2C; Supplier Part Number 2: 507-2072-6-ND; Series: 0ZCF0300BF2C
FB6 = FBMH4532HM681-T: as FB2 on sheet 4V_DIST; ComponentLink1Description: Manufacturer URL; ComponentLink2Description: Datasheet; DatasheetVersion: 09/2014; ComponentLink3URL: http://www.yuden.co.jp/productdata/catalog/en/chipbeads01_e.pdf; ComponentLink3Description: Package Specification; ComponentLink1URL: http://www.t-yuden.com/; Mounting Technology: Surface Mount; Packing: Taping; Temperature Range: -40 to 125 degC; PartNumber: FBMH4532HM681-T; PackageDescription: 2-Pin Surface Mount Device, Body 4.5 x 3.2 mm, Height 3.5 mm; ComponentLink2URL: http://www.yuden.co.jp/productdata/catalog/en/chipbeads01_e.pdf; RoHS: TRUE; Supplier 1: Digi-Key; Supplier Part Number 1: 587-1761-6-ND
J6 = Header_TE_Connectivity_87224-3_3POS: Headers & Wire Housings UNSHRD VERT SNGL 3; Supplier 1: Mouser; Supplier Part Number 1: 571-872243
Q2 Q4 = Mos_ROHM_EM6K6T2R_N_300mA: MOSFET Small Signal Dual N-CH 20V .3A .15W; Supplier Part Number 1: 755-EM6K6T2R; Supplier 1: Mouser
Q3 = BJT_PNP_Toshiba_TMBT3906: Bipolar Transistors - BJT Transistor for Low Freq. Amplification; Supplier 1: Mouser; Supplier Part Number 1: TMBT3906,LM
Q37 = Mos_ROHM_RSJ250P10FRATL_25A: as Q1 on sheet 4V_DIST; Supplier Part Number 1: 755-RSJ250P10FRATL; Supplier 1: Mouser
R20 R24 = Res_Vishay_CRCW04020000Z0EDC_0_Ohm: 0R 0.062W 1% 0402 (1005 Metric)  SMD; Supplier 1: Mouser; Supplier Part Number 1: 71-CRCW04020000Z0EDC
R21 R29 R32 = CMP-1012-00070-1: 680R 0.1W 5% 0603 (1608 Metric)  SMD; Case-EIA: 0603; Value: 680.00 Ohm; Case-Metric: 1608; Tolerance: 5 %; Technology: SMT; Power: 0.1 W
R22 R26 R28 R30 R34 = CMP-1012-00114-1: as R2 on sheet 4V_DIST; Tolerance: 5 %; Power: 0.1 W; Technology: SMT
R23 = CMP-1012-00122-1: 100K 0.1W 5% 0603 (1608 Metric)  SMD; Case-EIA: 0603; Value: 100000.00 Ohm; Case-Metric: 1608; Tolerance: 5 %; Power: 0.1 W; Technology: SMT
R25 = CMP-1012-00098-1: 10K 0.1W 5% 0603 (1608 Metric)  SMD; Case-EIA: 0603; Value: 10000.00 Ohm; Case-Metric: 1608; Technology: SMT; Tolerance: 5 %; Power: 0.1 W
R27 R36 = CMP-1012-00074-1: 1K 0.1W 5% 0603 (1608 Metric)  SMD; Case-EIA: 0603; Case-Metric: 1608; Value: 1000.00 Ohm; Technology: SMT; Tolerance: 5 %; Power: 0.1 W
R66 = CMP-1012-00110-1: 33K 0.1W 5% 0603 (1608 Metric)  SMD; Value: 33000.00 Ohm; Case-EIA: 0603; Case-Metric: 1608; Tolerance: 5 %; Power: 0.1 W; Technology: SMT
S1 S2 = SPDT_C&K_KSC421J70SHLFSPF_50mA: Tactile Switches Tact 6.2 x 6.2, 5.1 mm H, 1.7N, J leads, Potting Friendly, IP67; Supplier 1: Mouser; Supplier Part Number 1: 611-KSC421J70SHLFSPF
TP36 TP95 = TP_Harwin_S2761_46R: as TP1 on sheet 4V_DIST; Supplier 1: Newark; Supplier Part Number 1: 76Y5391
TP37 TP96 = TP_Keystone_Electronics_5006: as TP3 on sheet 4V_DIST; Supplier 1: Mouser; Supplier Part Number 1: 534-5006
U16 = INA226AQDGSRQ1: Current & Power Monitors & Regulators Automotive, 36-V, Ultra-High Accuracy, Low-/High-Side, I2C Out Current/Power Monitor w/ Alert 10-VSSOP -40 to 125; Supplier 1: Mouser; Supplier Part Number 1: 595-INA226AQDGSRQ1
U62 = CMP-0395-00444-2: Single Output High PSRR LDO, 500 mA, Fixed 2.5 V Output, 2.7 to 5.5 V Input, 6-pin SOT-223 (DCQ), -40 to 125 degC, Green (RoHS & no Sb/Br); Manufacturer: Texas Instruments; Iout(Max)(A): 0.5; Vout Adj(Min)(V): 2.5; Vin(Max)(V): 5.5; SubFamily: Single Channel LDO; Vdo(Typ)(mV): 110; Rating: Catalog; Accuracy(%): 2; Iq(Typ)(mA): 0.26; Vin(Min)(V): 2.7; ComponentLink3URL: http://www.ti.com/litv/pdf/mpds098c; ComponentLink1URL: http://www.ti.com/; Eco-Plan: Green (RoHS & no Sb/Br); PackageDescription: 6-Pin Plastic Small Outline, Body 3.5 x 6.5 mm, Pitch 1.27 mm; PartNumber: TPS79525DCQR; Fixed Output Options(V): 2.5; ComponentLink1Description: Manufacturer URL; PackageReference: DCQ0006A; ComponentLink2Description: Datasheet; Vout Adj(Max)(V): 2.5; ComponentLink3Description: Package Specification; ComponentLink2URL: http://www.ti.com/general/docs/lit/getliterature.tsp?genericPartNumber=TPS79525&fileType=pdf; Mounting Technology: Surface Mount; DatasheetVersion: SLVS350H; PackageVersion: 4202109/D; Supplier 1: Mouser; Supplier Part Number 1: 595-TPS79525DCQR

## Sheet MARS_PORB.SchDoc: MAR_PORB.schDoc
size A4
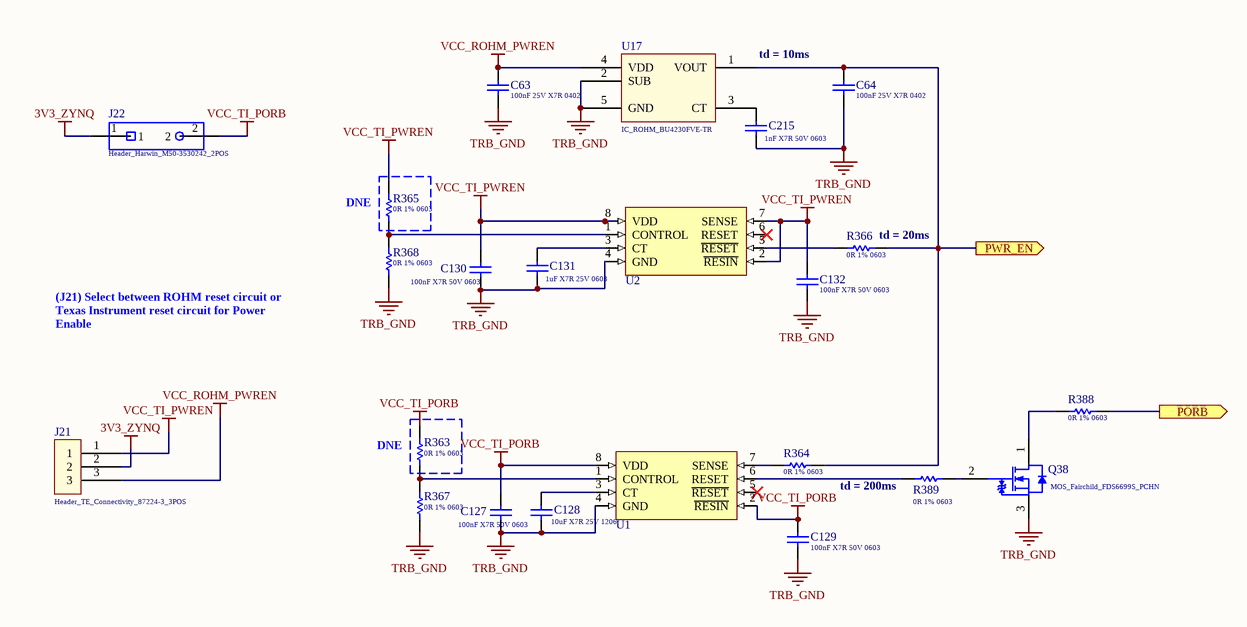
[diagram p20: MARS_PORB.SchDoc]

### Parts
C63  Capacitance: 100nF 25V X7R 0402  [Cap_Taiyo_Yuden_TMK105B7104KV-FR_100nF]  (hidden comment: Cap_Taiyo_Yuden_TMK105B7104KV-FR_100nF)
C64  Capacitance: 100nF 25V X7R 0402  [Cap_Taiyo_Yuden_TMK105B7104KV-FR_100nF]  (hidden comment: Cap_Taiyo_Yuden_TMK105B7104KV-FR_100nF)
C127  Capacitance: 100nF X7R 50V 0603  [Cap_Kemet_C0603C104M5RACAUTO_100nF]  (hidden comment: Cap_Kemet_C0603C104M5RACAUTO_100nF)
C128  Capacitance: 10uF X7R 25V 1206  [Cap_Murata_GRM31CR71E106MA12L_10uF]  (hidden comment: Cap_Murata_GRM31CR71E106MA12L_10uF)
C129  Capacitance: 100nF X7R 50V 0603  [Cap_Kemet_C0603C104M5RACAUTO_100nF]  (hidden comment: Cap_Kemet_C0603C104M5RACAUTO_100nF)
C130  Capacitance: 100nF X7R 50V 0603  [Cap_Kemet_C0603C104M5RACAUTO_100nF]  (hidden comment: Cap_Kemet_C0603C104M5RACAUTO_100nF)
C131  Capacitance: 1uF X7R 25V 0603  [Cap_Murata_GCJ188R71E105KA01J_1uF]  (hidden comment: Cap_Murata_GCJ188R71E105KA01J_1uF)
C132  Capacitance: 100nF X7R 50V 0603  [Cap_Kemet_C0603C104M5RACAUTO_100nF]  (hidden comment: Cap_Kemet_C0603C104M5RACAUTO_100nF)
C215  Capacitance: 1nF X7R 50V 0603  [Cap_Kemet_C0603C102J5RACAUTO_1nF]  (hidden comment: Cap_Kemet_C0603C102J5RACAUTO_1nF)
J21  Header_TE_Connectivity_87224-3_3POS  [Header_TE_Connectivity_87224-3_3POS]
J22  Header_Harwin_M50-3530242_2POS  [Header_Harwin_M50-3530242_2POS]
Q38  MOS_Fairchild_FDS6699S_PCHN  [MOS_Fairchild_FDS6699S_PCHN]
R363  Resistance: 0R 1% 0603  [Res_Vishay_CRCW06030000Z0EAHP_0_Ohm_duplicate]  (hidden comment: Res_Vishay_CRCW06030000Z0EAHP_0_Ohm)
R364  Resistance: 0R 1% 0603  [Res_Vishay_CRCW06030000Z0EAHP_0_Ohm_duplicate]  (hidden comment: Res_Vishay_CRCW06030000Z0EAHP_0_Ohm)
R365  Resistance: 0R 1% 0603  [Res_Vishay_CRCW06030000Z0EAHP_0_Ohm_duplicate]  (hidden comment: Res_Vishay_CRCW06030000Z0EAHP_0_Ohm)
R366  Resistance: 0R 1% 0603  [Res_Vishay_CRCW06030000Z0EAHP_0_Ohm_duplicate]  (hidden comment: Res_Vishay_CRCW06030000Z0EAHP_0_Ohm)
R367  Resistance: 0R 1% 0603  [Res_Vishay_CRCW06030000Z0EAHP_0_Ohm_duplicate]  (hidden comment: Res_Vishay_CRCW06030000Z0EAHP_0_Ohm)
R368  Resistance: 0R 1% 0603  [Res_Vishay_CRCW06030000Z0EAHP_0_Ohm_duplicate]  (hidden comment: Res_Vishay_CRCW06030000Z0EAHP_0_Ohm)
R388  Resistance: 0R 1% 0603  [Res_Vishay_CRCW06030000Z0EAHP_0_Ohm_duplicate]  (hidden comment: Res_Vishay_CRCW06030000Z0EAHP_0_Ohm)
R389  Resistance: 0R 1% 0603  [Res_Vishay_CRCW06030000Z0EAHP_0_Ohm_duplicate]  (hidden comment: Res_Vishay_CRCW06030000Z0EAHP_0_Ohm)
U1  PMU_Texas_Instruments_TLC7733IPWR_2.93  [PMU_Texas_Instruments_TLC7733IPWR_2.93]  (value not drawn)
U2  PMU_Texas_Instruments_TLC7733IPWR_2.93  [PMU_Texas_Instruments_TLC7733IPWR_2.93]  (value not drawn)
U17  IC_ROHM_BU4230FVE-TR  [IC_ROHM_BU4230FVE-TR]

### Ports
PORB (out), PWR_EN (out)

### Nets
3V3_ZYNQ: J21.2 J22.1  [project net VCC_3V3]
TRB_GND: C63.1 C64.2 C127.2 C128.2 C129.2 C130.2 C131.1 C132.2 C215.1 Q38.3(S) R367.1 R368.1 U1.4(GND) U2.4(GND) U17.2(SUB) U17.5(GND)
VCC_ROHM_PWREN: C63.2 J21.3 U17.4(VDD)
VCC_TI_PORB: C127.1 C129.1 J22.2 R363.2 U1.2(~{RESIN}) U1.8(VDD)
VCC_TI_PWREN: C130.1 C132.1 J21.1 R365.1 U2.2(~{RESIN}) U2.7(SENSE) U2.8(VDD)
POR: R388.1 ; port PORB
POWER_EN: C64.1 R364.1 R366.1 U17.1(VOUT) ; port PWR_EN
NetC128_1: C128.1 U1.3(CT)
NetC131_2: C131.2 U2.3(CT)
NetC215_2: C215.2 U17.3(CT)
NetQ38_1: Q38.1(D) R388.2
NetQ38_2: Q38.2(G) R389.1
NetR363_1: R363.1 R367.2 U1.1(CONTROL)
NetR364_2: R364.2 U1.7(SENSE)
NetR365_2: R365.2 R368.2 U2.1(CONTROL)
NetR366_2: R366.2 U2.5(~{RESET})
NetR389_2: R389.2 U1.6(RESET)

Not connected (* = marked no-connect by the designer): U1 5(~{RESET})*; U2 6(RESET)*

### Notes on the sheet
- td = 10ms
- (near R365) DNE
- (near R366) td = 20ms
- (J21) Select between ROHM reset circuit or
  Texas Instrument reset circuit for Power Enable
- (near R363) DNE
- (near R389) td = 200ms

### Library data of the parts
C63 C64 = Cap_Taiyo_Yuden_TMK105B7104KV-FR_100nF: CAP CER 100nF 25V X7R 0402; Supplier 1: Mouser; Supplier Part Number 1: 963-TMK105B7104KV-FR
C127 C129 C130 C132 = Cap_Kemet_C0603C104M5RACAUTO_100nF: CAP CER 100nF 50V X7R 0603; Supplier 1: Mouser; Supplier Part Number 1: 80-C0603C104M5RAUTO
C128 = Cap_Murata_GRM31CR71E106MA12L_10uF: CAP CER 10uF 25V X7R 1206; Supplier 1: Mouser; Supplier Part Number 1: 81-GRM31CR71E106MA2L
C131 = Cap_Murata_GCJ188R71E105KA01J_1uF: CAP CER 1uF 25V X7R 0603; Supplier 1: Mouser; Supplier Part Number 1: 81-GCJ188R71E105KA1J
C215 = Cap_Kemet_C0603C102J5RACAUTO_1nF: CAP CER 1nF 50V X7R 0603; Supplier 1: Mouser; Supplier Part Number 1: 80-C0603C102J5RAUTO
J21 = Header_TE_Connectivity_87224-3_3POS: as J6 on sheet MarsCarrier_PWR; Supplier 1: Mouser; Supplier Part Number 1: 571-872243
J22 = Header_Harwin_M50-3530242_2POS: Headers & Wire Housings 2 WAY SIL VERT PC TAIL P/HDR; Supplier 1: Mouser; Supplier Part Number 1: 855-M50-3530242
Q38 = MOS_Fairchild_FDS6699S_PCHN: MOSFET 30V N-Ch PowerTrench SyncFET
R363-R368 R388 R389 = Res_Vishay_CRCW06030000Z0EAHP_0_Ohm: 0R 0.25W 1% 0603 (1608 Metric)  SMD; Supplier 1: Mouser; Supplier Part Number 1: 71-CRCW06030000Z0EAH
U1 U2 = PMU_Texas_Instruments_TLC7733IPWR_2.93: Supervisory Circuits 2.93V Monitor
U17 = IC_ROHM_BU4230FVE-TR: Supervisory Circuits LOW VOLT DETECT VOL; Supplier 1: Mouser; Supplier Part Number 1: BU4230FVE-TR

## Sheet 3V3_DIST_ZYNQ.SchDoc: My title
size A3; Organization: University of California; Address1: 475 Portola Plaza; Address2: Los Angeles, CA 90095; Revision: R01; SheetNumber: 1; SheetTotal: 1
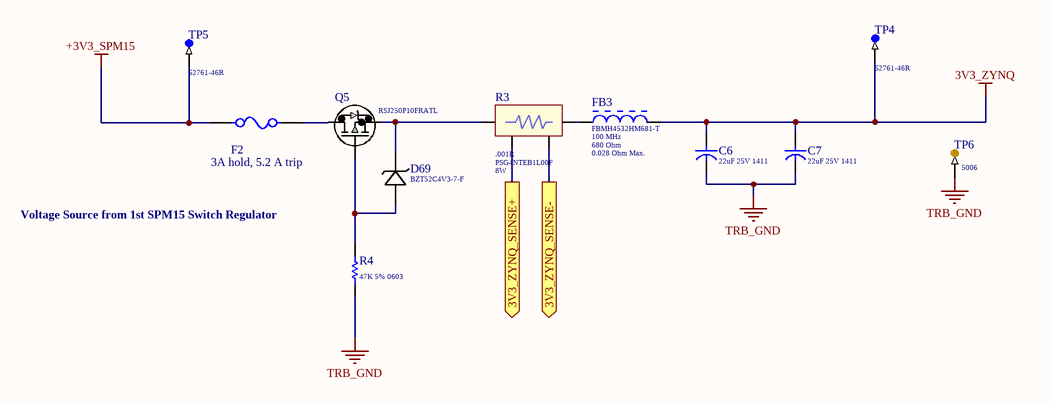
[diagram p21: 3V3_DIST_ZYNQ.SchDoc]

### Parts
C6  Capacitance: 22uF 25V 1411  [Cap_Kemet_T521B226M025ATE100_22uF]  (hidden comment: Cap_Kemet_T521B226M025ATE100_22uF)
C7  Capacitance: 22uF 25V 1411  [Cap_Kemet_T521B226M025ATE100_22uF]  (hidden comment: Cap_Kemet_T521B226M025ATE100_22uF)
D69  BZT52C4V3-7-F  [SOD123]
F2  3A hold, 5.2 A trip  [Bel_0ZCF_MFG]
FB3  Measuring Frequency: 100 MHz  Nominal Impedance: 680 Ohm  DC Resistance: 0.028 Ohm Max.  [TAYO-FBMH4532-2_V]  (hidden comment: FBMH4532HM681-T)
Q5  Series: RSJ250P10FRATL  [Mos_ROHM_RSJ250P10FRATL_25A]  (hidden comment: Mos_ROHM_RSJ250P10FRATL_25A)
R3  Resistance: .001R  Series: PSG4NTEB1L00F  Parameter 1: 8W  [SRes_KOA_PSG4NTEB1L00F_1mOhm]  (hidden comment: SRes_KOA_PSG4NTEB1L00F_1mOhm)
R4  47K 5% 0603  [RESC0603(1608)_L]
TP4  Series: S2761-46R  [TP_Harwin_S2761_46R]  (hidden comment: TP_Harwin_S2761_46R)
TP5  Series: S2761-46R  [TP_Harwin_S2761_46R]  (hidden comment: TP_Harwin_S2761_46R)
TP6  Series: 5006  [TP_Keystone_Electronics_5006]  (hidden comment: TP_Keystone_Electronics_5006)

### Ports
3V3_ZYNQ_SENSE+ (out), 3V3_ZYNQ_SENSE- (out)

### Nets
3V3_ZYNQ: C6.1 C7.1 FB3.2 TP4.1  [project net VCC_3V3]
+3V3_SPM15: F2.1 TP5.1
TRB_GND: C6.2 C7.2 R4.1 TP6.1
3V3_ZYNQ_SENSE_N: R3.3 ; port 3V3_ZYNQ_SENSE-
3V3_ZYNQ_SENSE_P: R3.4 ; port 3V3_ZYNQ_SENSE+
NetD69_1: D69.1 Q5.3(S) R3.1
NetD69_2: D69.2 Q5.1(G) R4.2
NetF2_2: F2.2 Q5.2(D)
NetFB3_1: FB3.1 R3.2

### Notes on the sheet
- Voltage Source from 1st SPM15 Switch Regulator
- 475 Portola Plaza
- GAPS TOF
- igarcia91@g.ucla.edu
- Los Angeles, CA
- 310-825-0344
- Size:
- Date:
- Letter
- Number:
- Time:
- Sheet
- Revision:
- of
- andrew.peck@cern.ch
- spq@ucla.edu
- File:

### Library data of the parts
C6 C7 = Cap_Kemet_T521B226M025ATE100_22uF: as C4 on sheet 4V_DIST; Supplier 1: Mouser; Supplier Part Number 1: 80-T521B226M25ATE100
D69 = BZT52C4V3-7-F: as D68 on sheet 4V_DIST; Manufacturer_Part_Number: BZT52C4V3-7-F; RefDes: RefDes; Supplier 1: Mouser; Supplier Part Number 1: 621-BZT52C4V3-F; Series: BZT52C4V3-7-F
F2 = 0ZCF0300BF2C: as F1 on sheet 4V_DIST; Supplier 1: Mouser; Supplier 2: Digi-Key; Supplier Part Number 1: 530-0ZCF0300BF2C; Supplier Part Number 2: 507-2072-6-ND
FB3 = FBMH4532HM681-T: as FB2 on sheet 4V_DIST; ComponentLink1Description: Manufacturer URL; ComponentLink2Description: Datasheet; DatasheetVersion: 09/2014; ComponentLink3URL: http://www.yuden.co.jp/productdata/catalog/en/chipbeads01_e.pdf; ComponentLink3Description: Package Specification; ComponentLink1URL: http://www.t-yuden.com/; Mounting Technology: Surface Mount; Packing: Taping; Temperature Range: -40 to 125 degC; PartNumber: FBMH4532HM681-T; PackageDescription: 2-Pin Surface Mount Device, Body 4.5 x 3.2 mm, Height 3.5 mm; ComponentLink2URL: http://www.yuden.co.jp/productdata/catalog/en/chipbeads01_e.pdf; RoHS: TRUE; Supplier 1: Digi-Key; Supplier Part Number 1: 587-1761-6-ND
Q5 = Mos_ROHM_RSJ250P10FRATL_25A: as Q1 on sheet 4V_DIST; Supplier 1: Mouser; Supplier Part Number 1: 755-RSJ250P10FRATL
R3 = SRes_KOA_PSG4NTEB1L00F_1mOhm: as R1 on sheet 4V_DIST; Supplier 1: Mouser; Supplier Part Number 1: 660-PSG4NTEB1L00F
R4 = CMP-1012-00114-1: as R2 on sheet 4V_DIST; Tolerance: 5 %; Power: 0.1 W; Technology: SMT
TP4 TP5 = TP_Harwin_S2761_46R: as TP1 on sheet 4V_DIST; Supplier 1: Newark; Supplier Part Number 1: 76Y5391
TP6 = TP_Keystone_Electronics_5006: as TP3 on sheet 4V_DIST; Supplier 1: Mouser; Supplier Part Number 1: 534-5006

## Sheet 3_3V_DIST.SchDoc: My title
size A3; Organization: University of California; Address1: 475 Portola Plaza; Address2: Los Angeles, CA 90095; Revision: R01; SheetNumber: 1; SheetTotal: 1
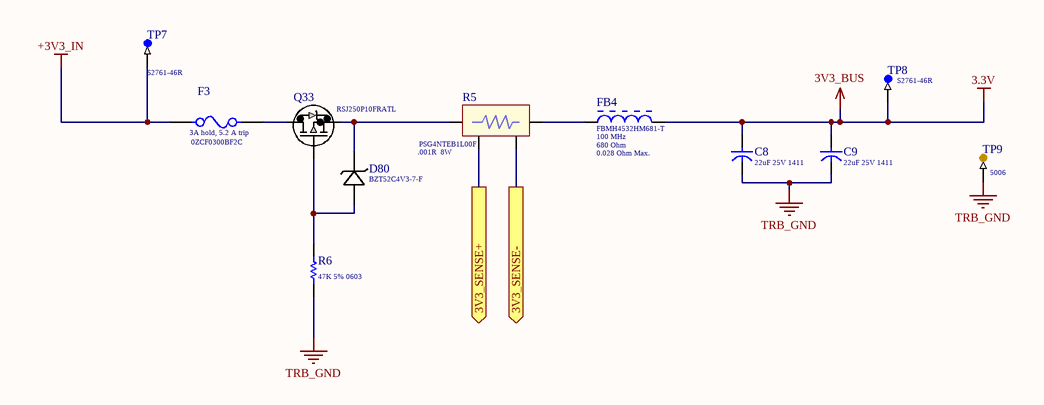
[diagram p22: 3_3V_DIST.SchDoc]

### Parts
C8  Capacitance: 22uF 25V 1411  [Cap_Kemet_T521B226M025ATE100_22uF]  (hidden comment: Cap_Kemet_T521B226M025ATE100_22uF)
C9  Capacitance: 22uF 25V 1411  [Cap_Kemet_T521B226M025ATE100_22uF]  (hidden comment: Cap_Kemet_T521B226M025ATE100_22uF)
D80  BZT52C4V3-7-F  [SOD123]
F3  3A hold, 5.2 A trip  [Bel_0ZCF_MFG]
FB4  Measuring Frequency: 100 MHz  Nominal Impedance: 680 Ohm  DC Resistance: 0.028 Ohm Max.  [TAYO-FBMH4532-2_V]  (hidden comment: FBMH4532HM681-T)
Q33  Series: RSJ250P10FRATL  [Mos_ROHM_RSJ250P10FRATL_25A]  (hidden comment: Mos_ROHM_RSJ250P10FRATL_25A)
R5  Resistance: .001R  Series: PSG4NTEB1L00F  Parameter 1: 8W  [SRes_KOA_PSG4NTEB1L00F_1mOhm]  (hidden comment: SRes_KOA_PSG4NTEB1L00F_1mOhm)
R6  47K 5% 0603  [RESC0603(1608)_L]
TP7  Series: S2761-46R  [TP_Harwin_S2761_46R]  (hidden comment: TP_Harwin_S2761_46R)
TP8  Series: S2761-46R  [TP_Harwin_S2761_46R]  (hidden comment: TP_Harwin_S2761_46R)
TP9  Series: 5006  [TP_Keystone_Electronics_5006]  (hidden comment: TP_Keystone_Electronics_5006)

### Ports
3V3_SENSE+ (out), 3V3_SENSE- (out)

### Nets
3.3V: C8.1 C9.1 FB4.2 TP8.1  [also labelled 3V3_BUS]
+3V3_IN: F3.1 TP7.1
TRB_GND: C8.2 C9.2 R6.1 TP9.1
3V3_SENSE_N: R5.3 ; port 3V3_SENSE-
3V3_SENSE_P: R5.4 ; port 3V3_SENSE+
NetD80_1: D80.1 Q33.3(S) R5.1
NetD80_2: D80.2 Q33.1(G) R6.2
NetF3_2: F3.2 Q33.2(D)
NetFB4_1: FB4.1 R5.2

### Notes on the sheet
- 475 Portola Plaza
- GAPS TOF
- igarcia91@g.ucla.edu
- Los Angeles, CA
- 310-825-0344
- Size:
- Date:
- Letter
- Number:
- Time:
- Sheet
- Revision:
- of
- andrew.peck@cern.ch
- spq@ucla.edu
- File:

### Library data of the parts
C8 C9 = Cap_Kemet_T521B226M025ATE100_22uF: as C4 on sheet 4V_DIST; Supplier 1: Mouser; Supplier Part Number 1: 80-T521B226M25ATE100
D80 = BZT52C4V3-7-F: as D68 on sheet 4V_DIST; Manufacturer_Part_Number: BZT52C4V3-7-F; RefDes: RefDes; Supplier 1: Mouser; Supplier Part Number 1: 621-BZT52C4V3-F; Series: BZT52C4V3-7-F
F3 = 0ZCF0300BF2C: as F1 on sheet 4V_DIST; Supplier 1: Mouser; Supplier 2: Digi-Key; Supplier Part Number 1: 530-0ZCF0300BF2C; Supplier Part Number 2: 507-2072-6-ND; Series: 0ZCF0300BF2C
FB4 = FBMH4532HM681-T: as FB2 on sheet 4V_DIST; ComponentLink1Description: Manufacturer URL; ComponentLink2Description: Datasheet; DatasheetVersion: 09/2014; ComponentLink3URL: http://www.yuden.co.jp/productdata/catalog/en/chipbeads01_e.pdf; ComponentLink3Description: Package Specification; ComponentLink1URL: http://www.t-yuden.com/; Mounting Technology: Surface Mount; Packing: Taping; Temperature Range: -40 to 125 degC; PartNumber: FBMH4532HM681-T; PackageDescription: 2-Pin Surface Mount Device, Body 4.5 x 3.2 mm, Height 3.5 mm; ComponentLink2URL: http://www.yuden.co.jp/productdata/catalog/en/chipbeads01_e.pdf; RoHS: TRUE; Supplier 1: Digi-Key; Supplier Part Number 1: 587-1761-6-ND
Q33 = Mos_ROHM_RSJ250P10FRATL_25A: as Q1 on sheet 4V_DIST; Supplier 1: Mouser; Supplier Part Number 1: 755-RSJ250P10FRATL
R5 = SRes_KOA_PSG4NTEB1L00F_1mOhm: as R1 on sheet 4V_DIST; Supplier 1: Mouser; Supplier Part Number 1: 660-PSG4NTEB1L00F
R6 = CMP-1012-00114-1: as R2 on sheet 4V_DIST; Tolerance: 5 %; Power: 0.1 W; Technology: SMT
TP7 TP8 = TP_Harwin_S2761_46R: as TP1 on sheet 4V_DIST; Supplier 1: Newark; Supplier Part Number 1: 76Y5391
TP9 = TP_Keystone_Electronics_5006: as TP3 on sheet 4V_DIST; Supplier 1: Mouser; Supplier Part Number 1: 534-5006